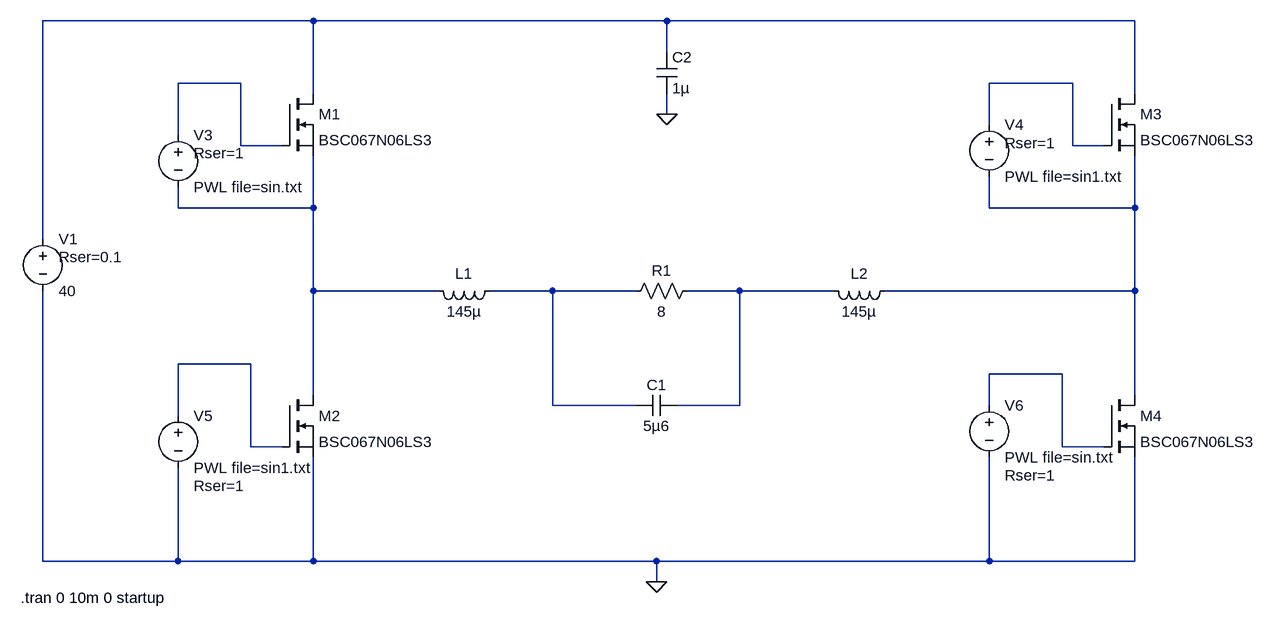
[diagram p0: schematic CLASS D  _40V 100W.asc]
CLASS D  _40V 100W.asc, the LTspice schematic file:
Version 4
SHEET 1 1460 680
WIRE -16 -416 -432 -416
WIRE 528 -416 -16 -416
WIRE 1248 -416 528 -416
WIRE 528 -368 528 -416
WIRE -128 -320 -224 -320
WIRE 1152 -320 1024 -320
WIRE -16 -304 -16 -416
WIRE 1248 -304 1248 -416
WIRE 528 -272 528 -304
WIRE 1024 -256 1024 -320
WIRE -224 -240 -224 -320
WIRE -128 -224 -128 -320
WIRE -64 -224 -128 -224
WIRE 1152 -224 1152 -320
WIRE 1200 -224 1152 -224
WIRE -224 -128 -224 -160
WIRE -16 -128 -16 -208
WIRE -16 -128 -224 -128
WIRE 1024 -128 1024 -176
WIRE 1248 -128 1248 -208
WIRE 1248 -128 1024 -128
WIRE -432 -80 -432 -416
WIRE -16 0 -16 -128
WIRE 176 0 -16 0
WIRE 352 0 256 0
WIRE 480 0 352 0
WIRE 640 0 560 0
WIRE 784 0 640 0
WIRE 1248 0 1248 -128
WIRE 1248 0 864 0
WIRE -112 112 -224 112
WIRE 1136 128 1024 128
WIRE -16 160 -16 0
WIRE 1248 160 1248 0
WIRE 352 176 352 0
WIRE 480 176 352 176
WIRE 640 176 640 0
WIRE 640 176 544 176
WIRE 1024 176 1024 128
WIRE -224 192 -224 112
WIRE -112 240 -112 112
WIRE -64 240 -112 240
WIRE 1136 240 1136 128
WIRE 1200 240 1136 240
WIRE -432 416 -432 0
WIRE -224 416 -224 272
WIRE -224 416 -432 416
WIRE -16 416 -16 256
WIRE -16 416 -224 416
WIRE 512 416 -16 416
WIRE 1024 416 1024 256
WIRE 1024 416 512 416
WIRE 1248 416 1248 256
WIRE 1248 416 1024 416
WIRE 512 448 512 416
FLAG 512 448 0
FLAG 528 -272 0
SYMBOL nmos -64 -304 R0
SYMATTR InstName M1
SYMATTR Value BSC067N06LS3
SYMBOL nmos -64 160 R0
SYMATTR InstName M2
SYMATTR Value BSC067N06LS3
SYMBOL nmos 1200 -304 R0
SYMATTR InstName M3
SYMATTR Value BSC067N06LS3
SYMBOL nmos 1200 160 R0
SYMATTR InstName M4
SYMATTR Value BSC067N06LS3
SYMBOL voltage -224 -256 R0
WINDOW 123 0 0 Left 2
WINDOW 39 24 44 Left 2
SYMATTR InstName V3
SYMATTR Value PWL file=sin.txt
SYMATTR SpiceLine Rser=1
SYMBOL voltage 1024 -272 R0
WINDOW 123 0 0 Left 2
WINDOW 39 24 44 Left 2
SYMATTR InstName V4
SYMATTR Value PWL file=sin1.txt
SYMATTR SpiceLine Rser=1
SYMBOL voltage -224 176 R0
WINDOW 123 0 0 Left 2
WINDOW 39 24 124 Left 2
SYMATTR InstName V5
SYMATTR Value PWL file=sin1.txt
SYMATTR SpiceLine Rser=1
SYMBOL voltage 1024 160 R0
WINDOW 123 0 0 Left 2
WINDOW 39 24 124 Left 2
SYMATTR InstName V6
SYMATTR Value PWL file=sin.txt
SYMATTR SpiceLine Rser=1
SYMBOL ind 272 -16 R90
WINDOW 0 5 56 VBottom 2
WINDOW 3 32 56 VTop 2
SYMATTR InstName L1
SYMATTR Value 145µ
SYMATTR SpiceLine Rser=0.05
SYMBOL ind 880 -16 R90
WINDOW 0 5 56 VBottom 2
WINDOW 3 32 56 VTop 2
SYMATTR InstName L2
SYMATTR Value 145µ
SYMATTR SpiceLine Rser=0.05
SYMBOL cap 544 160 R90
WINDOW 0 0 32 VBottom 2
WINDOW 3 32 32 VTop 2
SYMATTR InstName C1
SYMATTR Value 5µ6
SYMATTR SpiceLine Rser=0.03
SYMBOL res 576 -16 R90
WINDOW 0 0 56 VBottom 2
WINDOW 3 32 56 VTop 2
SYMATTR InstName R1
SYMATTR Value 8
SYMBOL voltage -432 -96 R0
WINDOW 123 0 0 Left 2
WINDOW 39 24 44 Left 2
SYMATTR InstName V1
SYMATTR Value 40
SYMATTR SpiceLine Rser=0.1
SYMBOL cap 512 -368 R0
SYMATTR InstName C2
SYMATTR Value 1µ
SYMATTR SpiceLine Rser=0.05
TEXT -466 472 Left 2 !.tran 0 10m 0 startup

The netlist it stands for:
* CLASS D  _40V 100W.asc
M1 N001 N002 N004 N004 BSC067N06LS3
M2 N004 N008 0 0 BSC067N06LS3
M3 N001 N003 N005 N005 BSC067N06LS3
M4 N005 N009 0 0 BSC067N06LS3
V3 N002 N004 PWL file=sin.txt Rser=1
V4 N003 N005 PWL file=sin1.txt Rser=1
V5 N008 0 PWL file=sin1.txt Rser=1
V6 N009 0 PWL file=sin.txt Rser=1
L1 N006 N004 145µ Rser=0.05
L2 N005 N007 145µ Rser=0.05
C1 N007 N006 5µ6 Rser=0.03
R1 N007 N006 8
V1 N001 0 40 Rser=0.1
C2 N001 0 1µ Rser=0.05
.model NMOS NMOS
.model PMOS PMOS
.lib standard.mos
.tran 0 10m 0 startup
.backanno
.end